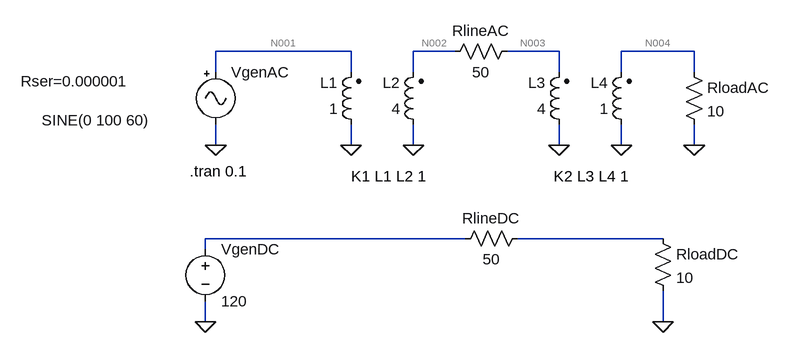
[diagram p0: schematic lab_2022-01-22.asc]
lab_2022-01-22.asc, the LTspice schematic file:
Version 4
SHEET 1 880 680
WIRE 0 128 -208 128
WIRE 160 128 96 128
WIRE 320 128 240 128
WIRE 528 128 416 128
WIRE -208 160 -208 128
WIRE 0 160 0 128
WIRE 96 160 96 128
WIRE 320 160 320 128
WIRE 416 160 416 128
WIRE 528 160 528 128
WIRE -208 272 -208 240
WIRE 0 272 0 240
WIRE 96 272 96 240
WIRE 320 272 320 240
WIRE 416 272 416 240
WIRE 528 272 528 240
WIRE 176 416 -224 416
WIRE 480 416 256 416
WIRE -224 432 -224 416
WIRE -224 544 -224 512
WIRE 480 544 480 496
FLAG -208 272 0
FLAG 0 272 0
FLAG 96 272 0
FLAG 320 272 0
FLAG 416 272 0
FLAG 528 272 0
FLAG -224 544 0
FLAG 480 544 0
SYMBOL ind2 16 256 R180
WINDOW 0 36 80 Left 2
WINDOW 3 36 40 Left 2
SYMATTR InstName L1
SYMATTR Value 1
SYMATTR Type ind
SYMBOL ind2 112 256 R180
WINDOW 0 36 80 Left 2
WINDOW 3 36 40 Left 2
SYMATTR InstName L2
SYMATTR Value 4
SYMATTR Type ind
SYMBOL ind2 336 256 R180
WINDOW 0 36 80 Left 2
WINDOW 3 36 40 Left 2
SYMATTR InstName L3
SYMATTR Value 4
SYMATTR Type ind
SYMBOL ind2 432 256 R180
WINDOW 0 36 80 Left 2
WINDOW 3 36 40 Left 2
SYMATTR InstName L4
SYMATTR Value 1
SYMATTR Type ind
SYMBOL res 144 144 R270
WINDOW 0 32 56 VTop 2
WINDOW 3 0 56 VBottom 2
SYMATTR InstName RlineAC
SYMATTR Value 50
SYMBOL Misc\\signal -208 144 R0
WINDOW 3 -268 90 Left 2
WINDOW 123 0 0 Left 0
WINDOW 39 -300 30 Left 2
SYMATTR Value SINE(0 100 60)
SYMATTR SpiceLine Rser=0.000001
SYMATTR InstName VgenAC
SYMBOL res 512 144 R0
SYMATTR InstName RloadAC
SYMATTR Value 10
SYMBOL res 160 432 R270
WINDOW 0 32 56 VTop 2
WINDOW 3 0 56 VBottom 2
SYMATTR InstName RlineDC
SYMATTR Value 50
SYMBOL voltage -224 416 R0
SYMATTR InstName VgenDC
SYMATTR Value 120
SYMBOL res 464 400 R0
SYMATTR InstName RloadDC
SYMATTR Value 10
TEXT 0 320 Left 2 !K1 L1 L2 1
TEXT 312 320 Left 2 !K2 L3 L4 1
TEXT -248 312 Left 2 !.tran 0.1

The netlist it stands for:
* lab_2022-01-22.asc
L1 0 N001 1
L2 0 N002 4
L3 0 N003 4
L4 0 N004 1
RlineAC N002 N003 50
VgenAC N001 0 SINE(0 100 60) Rser=0.000001
RloadAC N004 0 10
RlineDC N005 N006 50
VgenDC N005 0 120
RloadDC N006 0 10
K1 L1 L2 1
K2 L3 L4 1
.tran 0.1
.backanno
.end

* Results of the author's LTspice run, read from the files saved beside the schematic
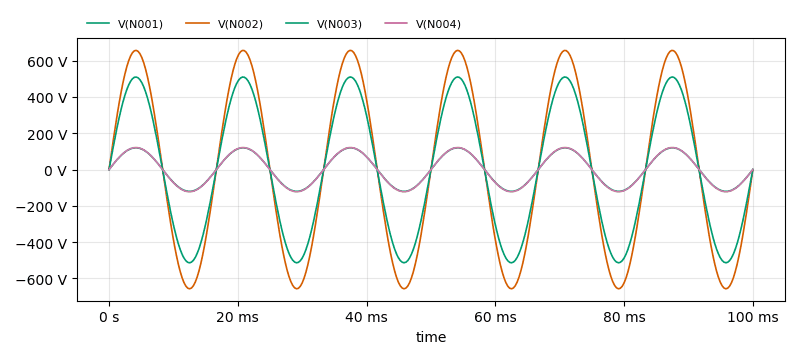
[diagram p1: Transient Analysis of lab_2022-01-22.asc, plotted from the saved traces]
* Transient Analysis, 1 run:
*   V(N001): min -120 V, max 120 V, average -72.34 µV, rms 84.85 V, last 0 V
*   V(N002): min -657 V, max 656.9 V, average -393.2 µV, rms 464.6 V, last 0 V
*   V(N003): min -513.7 V, max 510.3 V, average -1.655 V, rms 362 V, last 214.8 mV
*   V(N004): min -122.3 V, max 121.5 V, average -393.9 mV, rms 86.18 V, last 51.12 mV